# Altium schematic sheet INC-IO1616001.SchDoc
size A1
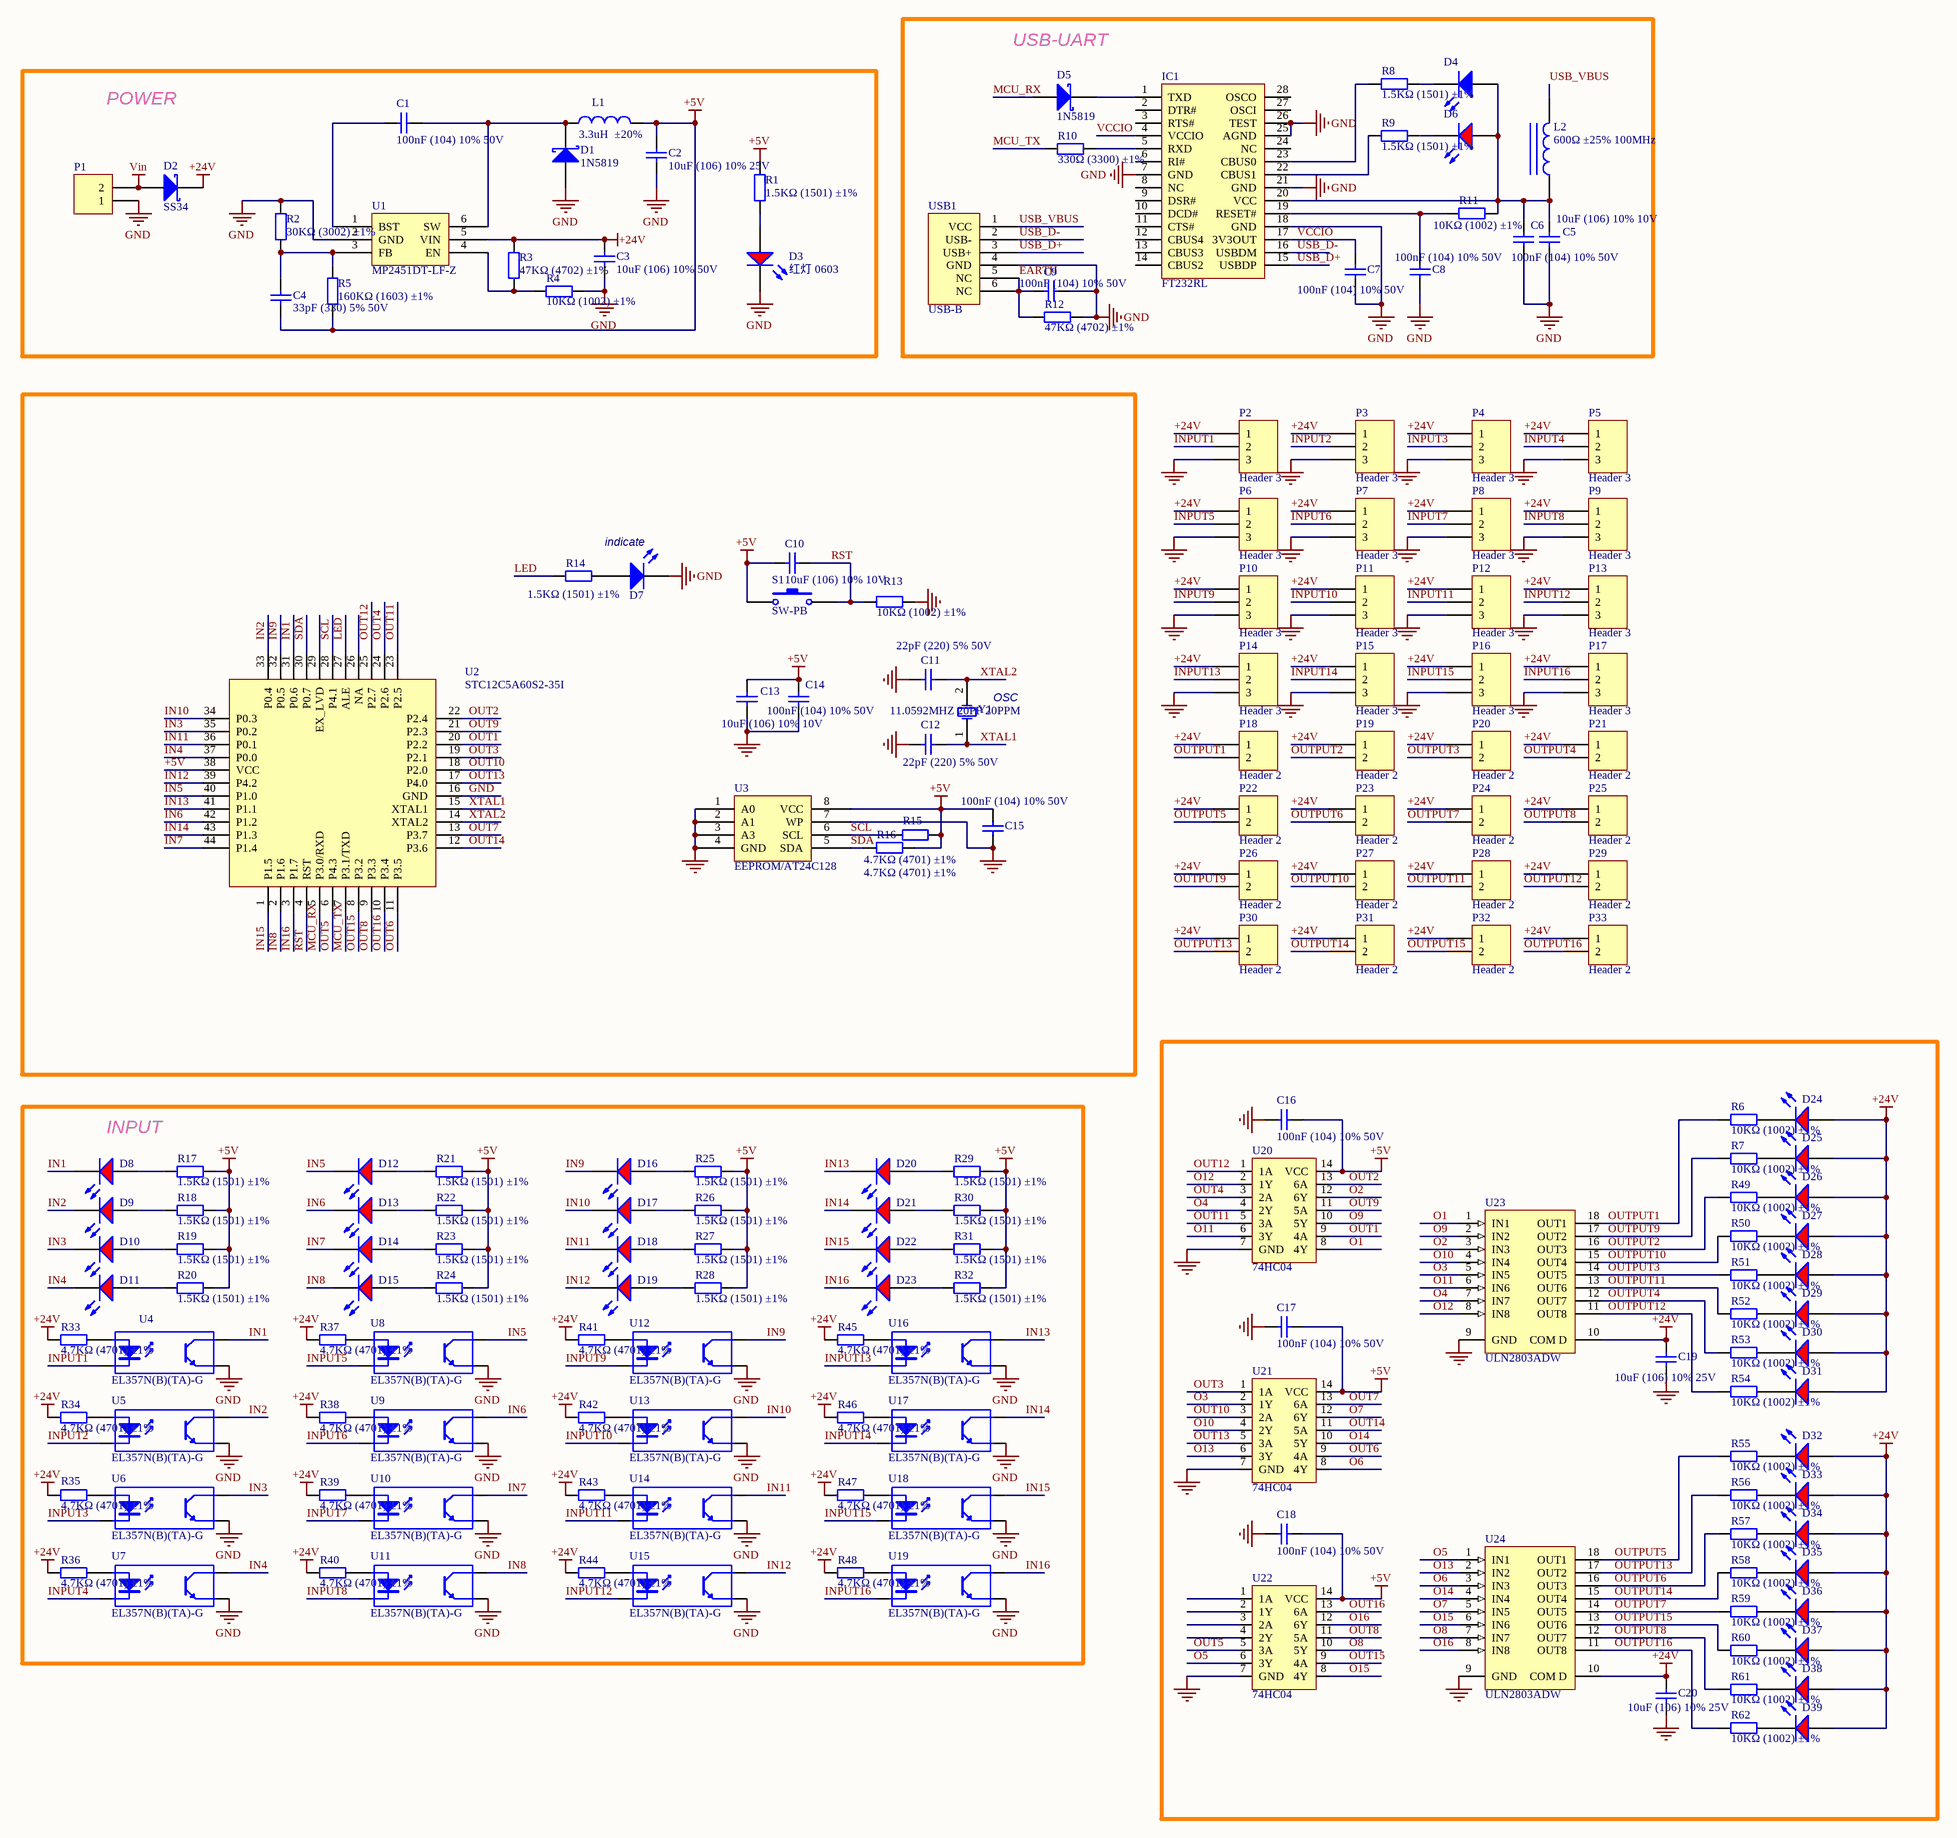
[diagram p0: INC-IO1616001.SchDoc]

## Parts
C1  100nF (104) 10% 50V  [0603_C]
C2  10uF (106) 10% 25V  [0805_C]
C3  10uF (106) 10% 50V  [1206_C]
C4  33pF (330) 5% 50V  [0603_C]
C5  10uF (106) 10% 10V  [0603_C]
C6  100nF (104) 10% 50V  [0603_C]
C7  100nF (104) 10% 50V  [0603_C]
C8  100nF (104) 10% 50V  [0603_C]
C9  100nF (104) 10% 50V  [0603_C]
C10  10uF (106) 10% 10V  [0603_C]
C11  22pF (220) 5% 50V  [0603_C]
C12  22pF (220) 5% 50V  [0603_C]
C13  10uF (106) 10% 10V  [0603_C]
C14  100nF (104) 10% 50V  [0603_C]
C15  100nF (104) 10% 50V  [0603_C]
C16  100nF (104) 10% 50V  [0603_C]
C17  100nF (104) 10% 50V  [0603_C]
C18  100nF (104) 10% 50V  [0603_C]
C19  10uF (106) 10% 25V  [0805_C]
C20  10uF (106) 10% 25V  [0805_C]
D1  1N5819  [SOD-123]
D2  SS34  [SMA(DO-214AC)_S1]
D3  红灯 0603  [0603_LED_S1]
D4  蓝灯 0603  [0603_LED_S1]  (value not drawn)
D5  1N5819  [SOD-123]
D6  红灯 0603  [0603_LED_S1]  (value not drawn)
D7  蓝灯 0603  [0603_LED_S1]  (value not drawn)
D8  红灯 0603  [0603_LED_S1]  (value not drawn)
D9  红灯 0603  [0603_LED_S1]  (value not drawn)
D10  红灯 0603  [0603_LED_S1]  (value not drawn)
D11  红灯 0603  [0603_LED_S1]  (value not drawn)
D12  红灯 0603  [0603_LED_S1]  (value not drawn)
D13  红灯 0603  [0603_LED_S1]  (value not drawn)
D14  红灯 0603  [0603_LED_S1]  (value not drawn)
D15  红灯 0603  [0603_LED_S1]  (value not drawn)
D16  红灯 0603  [0603_LED_S1]  (value not drawn)
D17  红灯 0603  [0603_LED_S1]  (value not drawn)
D18  红灯 0603  [0603_LED_S1]  (value not drawn)
D19  红灯 0603  [0603_LED_S1]  (value not drawn)
D20  红灯 0603  [0603_LED_S1]  (value not drawn)
D21  红灯 0603  [0603_LED_S1]  (value not drawn)
D22  红灯 0603  [0603_LED_S1]  (value not drawn)
D23  红灯 0603  [0603_LED_S1]  (value not drawn)
D24  红灯 0603  [0603_LED_S1]  (value not drawn)
D25  红灯 0603  [0603_LED_S1]  (value not drawn)
D26  红灯 0603  [0603_LED_S1]  (value not drawn)
D27  红灯 0603  [0603_LED_S1]  (value not drawn)
D28  红灯 0603  [0603_LED_S1]  (value not drawn)
D29  红灯 0603  [0603_LED_S1]  (value not drawn)
D30  红灯 0603  [0603_LED_S1]  (value not drawn)
D31  红灯 0603  [0603_LED_S1]  (value not drawn)
D32  红灯 0603  [0603_LED_S1]  (value not drawn)
D33  红灯 0603  [0603_LED_S1]  (value not drawn)
D34  红灯 0603  [0603_LED_S1]  (value not drawn)
D35  红灯 0603  [0603_LED_S1]  (value not drawn)
D36  红灯 0603  [0603_LED_S1]  (value not drawn)
D37  红灯 0603  [0603_LED_S1]  (value not drawn)
D38  红灯 0603  [0603_LED_S1]  (value not drawn)
D39  红灯 0603  [0603_LED_S1]  (value not drawn)
IC1  FT232RL  [SSOP-28_208mil]
L1  3.3uH  ±20%  [L5020]
L2  600Ω ±25% 100MHz  [0805_L]
P1  Header 2  [WJ15EDGVC-3.81-2P]  (value not drawn)
P2  Header 3  [WJ15EDGVC-3.81-3P]
P3  Header 3  [WJ15EDGVC-3.81-3P]
P4  Header 3  [WJ15EDGVC-3.81-3P]
P5  Header 3  [WJ15EDGVC-3.81-3P]
P6  Header 3  [WJ15EDGVC-3.81-3P]
P7  Header 3  [WJ15EDGVC-3.81-3P]
P8  Header 3  [WJ15EDGVC-3.81-3P]
P9  Header 3  [WJ15EDGVC-3.81-3P]
P10  Header 3  [WJ15EDGVC-3.81-3P]
P11  Header 3  [WJ15EDGVC-3.81-3P]
P12  Header 3  [WJ15EDGVC-3.81-3P]
P13  Header 3  [WJ15EDGVC-3.81-3P]
P14  Header 3  [WJ15EDGVC-3.81-3P]
P15  Header 3  [WJ15EDGVC-3.81-3P]
P16  Header 3  [WJ15EDGVC-3.81-3P]
P17  Header 3  [WJ15EDGVC-3.81-3P]
P18  Header 2  [WJ15EDGVC-3.81-2P]
P19  Header 2  [WJ15EDGVC-3.81-2P]
P20  Header 2  [WJ15EDGVC-3.81-2P]
P21  Header 2  [WJ15EDGVC-3.81-2P]
P22  Header 2  [WJ15EDGVC-3.81-2P]
P23  Header 2  [WJ15EDGVC-3.81-2P]
P24  Header 2  [WJ15EDGVC-3.81-2P]
P25  Header 2  [WJ15EDGVC-3.81-2P]
P26  Header 2  [WJ15EDGVC-3.81-2P]
P27  Header 2  [WJ15EDGVC-3.81-2P]
P28  Header 2  [WJ15EDGVC-3.81-2P]
P29  Header 2  [WJ15EDGVC-3.81-2P]
P30  Header 2  [WJ15EDGVC-3.81-2P]
P31  Header 2  [WJ15EDGVC-3.81-2P]
P32  Header 2  [WJ15EDGVC-3.81-2P]
P33  Header 2  [WJ15EDGVC-3.81-2P]
R1  1.5KΩ (1501) ±1%  [0603_R]
R2  30KΩ (3002) ±1%  [0603_R]
R3  47KΩ (4702) ±1%  [0603_R]
R4  10KΩ (1002) ±1%  [0603_R]
R5  160KΩ (1603) ±1%  [0603_R]
R6  10KΩ (1002) ±1%  [0603_R]
R7  10KΩ (1002) ±1%  [0603_R]
R8  1.5KΩ (1501) ±1%  [0603_R]
R9  1.5KΩ (1501) ±1%  [0603_R]
R10  330Ω (3300) ±1%  [0603_R]
R11  10KΩ (1002) ±1%  [0603_R]
R12  47KΩ (4702) ±1%  [0603_R]
R13  10KΩ (1002) ±1%  [0603_R]
R14  1.5KΩ (1501) ±1%  [0603_R]
R15  4.7KΩ (4701) ±1%  [0603_R]
R16  4.7KΩ (4701) ±1%  [0603_R]
R17  1.5KΩ (1501) ±1%  [0603_R]
R18  1.5KΩ (1501) ±1%  [0603_R]
R19  1.5KΩ (1501) ±1%  [0603_R]
R20  1.5KΩ (1501) ±1%  [0603_R]
R21  1.5KΩ (1501) ±1%  [0603_R]
R22  1.5KΩ (1501) ±1%  [0603_R]
R23  1.5KΩ (1501) ±1%  [0603_R]
R24  1.5KΩ (1501) ±1%  [0603_R]
R25  1.5KΩ (1501) ±1%  [0603_R]
R26  1.5KΩ (1501) ±1%  [0603_R]
R27  1.5KΩ (1501) ±1%  [0603_R]
R28  1.5KΩ (1501) ±1%  [0603_R]
R29  1.5KΩ (1501) ±1%  [0603_R]
R30  1.5KΩ (1501) ±1%  [0603_R]
R31  1.5KΩ (1501) ±1%  [0603_R]
R32  1.5KΩ (1501) ±1%  [0603_R]
R33  4.7KΩ (4701) ±1%  [1206_R]
R34  4.7KΩ (4701) ±1%  [1206_R]
R35  4.7KΩ (4701) ±1%  [1206_R]
R36  4.7KΩ (4701) ±1%  [1206_R]
R37  4.7KΩ (4701) ±1%  [1206_R]
R38  4.7KΩ (4701) ±1%  [1206_R]
R39  4.7KΩ (4701) ±1%  [1206_R]
R40  4.7KΩ (4701) ±1%  [1206_R]
R41  4.7KΩ (4701) ±1%  [1206_R]
R42  4.7KΩ (4701) ±1%  [1206_R]
R43  4.7KΩ (4701) ±1%  [1206_R]
R44  4.7KΩ (4701) ±1%  [1206_R]
R45  4.7KΩ (4701) ±1%  [1206_R]
R46  4.7KΩ (4701) ±1%  [1206_R]
R47  4.7KΩ (4701) ±1%  [1206_R]
R48  4.7KΩ (4701) ±1%  [1206_R]
R49  10KΩ (1002) ±1%  [0603_R]
R50  10KΩ (1002) ±1%  [0603_R]
R51  10KΩ (1002) ±1%  [0603_R]
R52  10KΩ (1002) ±1%  [0603_R]
R53  10KΩ (1002) ±1%  [0603_R]
R54  10KΩ (1002) ±1%  [0603_R]
R55  10KΩ (1002) ±1%  [0603_R]
R56  10KΩ (1002) ±1%  [0603_R]
R57  10KΩ (1002) ±1%  [0603_R]
R58  10KΩ (1002) ±1%  [0603_R]
R59  10KΩ (1002) ±1%  [0603_R]
R60  10KΩ (1002) ±1%  [0603_R]
R61  10KΩ (1002) ±1%  [0603_R]
R62  10KΩ (1002) ±1%  [0603_R]
S1  SW-PB  [贴片按键 3*6*2.5]
U1  MP2451DT-LF-Z  [SOT-23-6]
U2  STC12C5A60S2-35I  [LQFP-44_10x10x08P]
U3  EEPROM/AT24C128  [SOIC-8_150mil]
U4  EL357N(B)(TA)-G  [SOP-4_P2.54]
U5  EL357N(B)(TA)-G  [SOP-4_P2.54]
U6  EL357N(B)(TA)-G  [SOP-4_P2.54]
U7  EL357N(B)(TA)-G  [SOP-4_P2.54]
U8  EL357N(B)(TA)-G  [SOP-4_P2.54]
U9  EL357N(B)(TA)-G  [SOP-4_P2.54]
U10  EL357N(B)(TA)-G  [SOP-4_P2.54]
U11  EL357N(B)(TA)-G  [SOP-4_P2.54]
U12  EL357N(B)(TA)-G  [SOP-4_P2.54]
U13  EL357N(B)(TA)-G  [SOP-4_P2.54]
U14  EL357N(B)(TA)-G  [SOP-4_P2.54]
U15  EL357N(B)(TA)-G  [SOP-4_P2.54]
U16  EL357N(B)(TA)-G  [SOP-4_P2.54]
U17  EL357N(B)(TA)-G  [SOP-4_P2.54]
U18  EL357N(B)(TA)-G  [SOP-4_P2.54]
U19  EL357N(B)(TA)-G  [SOP-4_P2.54]
U20  74HC04  [SOIC-14_150mil]
U21  74HC04  [SOIC-14_150mil]
U22  74HC04  [SOIC-14_150mil]
U23  ULN2803ADW  [SOIC-18_300mil]
U24  ULN2803ADW  [SOIC-18_300mil]
USB1  USB-B  [USB-b]
Y1  11.0592MHZ 20PF 20PPM  [SMD-5032_2P]

## Blocks framed on the sheet
USB-UART: C5-C9 D4-D6 IC1 L2 R8-R12 USB1
POWER: C1-C4 D1-D3 L1 P1 R1-R5 U1
INPUT: D8-D23 R17-R48 U4-U19

## Nets
+5V: C2.2 C4.2 C10.2 C13.2 C14.2 C15.2 C16.2 C17.2 C18.2 L1.2 R1.2 R5.1 R15.2 R16.2 R17.1 R18.1 R19.1 R20.1 R21.1 R22.1 R23.1 R24.1 R25.1 R26.1 R27.1 R28.1 R29.1 R30.1 R31.1 R32.1 S1.1 U2.38(VCC) U3.8(VCC) U20.14(VCC) U21.14(VCC) U22.14(VCC)
+24V: C3.2 C19.2 C20.2 D2.2(K) D24.A D25.A D26.A D27.A D28.A D29.A D30.A D31.A D32.A D33.A D34.A D35.A D36.A D37.A D38.A D39.A P2.1 P3.1 P4.1 P5.1 P6.1 P7.1 P8.1 P9.1 P10.1 P11.1 P12.1 P13.1 P14.1 P15.1 P16.1 P17.1 P18.1 P19.1 P20.1 P21.1 P22.1 P23.1 P24.1 P25.1 P26.1 P27.1 P28.1 P29.1 P30.1 P31.1 P32.1 P33.1 R3.1 R33.1 R34.1 R35.1 R36.1 R37.1 R38.1 R39.1 R40.1 R41.1 R42.1 R43.1 R44.1 R45.1 R46.1 R47.1 R48.1 U1.5(VIN) U23.10(COM_D) U24.10(COM_D)
GND: C2.1 C3.1 C5.1 C6.1 C7.1 C8.1 C9.2 C11.2 C12.2 C13.1 C14.1 C15.1 C16.1 C17.1 C18.1 C19.1 C20.1 D1.1(A) D3.K D7.K IC1.7(GND) IC1.18(GND) IC1.21(GND) IC1.25(AGND) IC1.26(TEST) P1.1 P2.3 P3.3 P4.3 P5.3 P6.3 P7.3 P8.3 P9.3 P10.3 P11.3 P12.3 P13.3 P14.3 P15.3 P16.3 P17.3 R2.2 R4.2 R12.2 R13.2 U1.2(GND) U2.16(GND) U3.1(A0) U3.2(A1) U3.3(A3) U3.4(GND) U3.7(WP) U4.3(E) U5.3(E) U6.3(E) U7.3(E) U8.3(E) U9.3(E) U10.3(E) U11.3(E) U12.3(E) U13.3(E) U14.3(E) U15.3(E) U16.3(E) U17.3(E) U18.3(E) U19.3(E) U20.7(GND) U21.7(GND) U22.7(GND) U23.9(GND) U24.9(GND) USB1.4(GND)
Vin: D2.1(A) P1.2
EARTH: C9.1 R12.1 USB1.5(NC) USB1.6(NC)
IN1: D8.K U2.31(P0.6) U4.4(C)
IN2: D9.K U2.33(P0.4) U5.4(C)
IN3: D10.K U2.35(P0.2) U6.4(C)
IN4: D11.K U2.37(P0.0) U7.4(C)
IN5: D12.K U2.40(P1.0) U8.4(C)
IN6: D13.K U2.42(P1.2) U9.4(C)
IN7: D14.K U2.44(P1.4) U10.4(C)
IN8: D15.K U2.2(P1.6) U11.4(C)
IN9: D16.K U2.32(P0.5) U12.4(C)
IN10: D17.K U2.34(P0.3) U13.4(C)
IN11: D18.K U2.36(P0.1) U14.4(C)
IN12: D19.K U2.39(P4.2) U15.4(C)
IN13: D20.K U2.41(P1.1) U16.4(C)
IN14: D21.K U2.43(P1.3) U17.4(C)
IN15: D22.K U2.1(P1.5) U18.4(C)
IN16: D23.K U2.3(P1.7) U19.4(C)
INPUT1: P2.2 U4.2(K)
INPUT2: P3.2 U5.2(K)
INPUT3: P4.2 U6.2(K)
INPUT4: P5.2 U7.2(K)
INPUT5: P6.2 U8.2(K)
INPUT6: P7.2 U9.2(K)
INPUT7: P8.2 U10.2(K)
INPUT8: P9.2 U11.2(K)
INPUT9: P10.2 U12.2(K)
INPUT10: P11.2 U13.2(K)
INPUT11: P12.2 U14.2(K)
INPUT12: P13.2 U15.2(K)
INPUT13: P14.2 U16.2(K)
INPUT14: P15.2 U17.2(K)
INPUT15: P16.2 U18.2(K)
INPUT16: P17.2 U19.2(K)
LED: R14.2 U2.27(ALE)
MCU_RX: D5.1(A) U2.5(P3.0/RXD)
MCU_TX: R10.1 U2.7(P3.1/TXD)
O1: U20.8(4Y) U23.1(IN1)
O2: U20.12(6Y) U23.3(IN3)
O3: U21.2(1Y) U23.5(IN5)
O4: U20.4(2Y) U23.7(IN7)
O5: U22.6(3Y) U24.1(IN1)
O6: U21.8(4Y) U24.3(IN3)
O7: U21.12(6Y) U24.5(IN5)
O8: U22.10(5Y) U24.7(IN7)
O9: U20.10(5Y) U23.2(IN2)
O10: U21.4(2Y) U23.4(IN4)
O11: U20.6(3Y) U23.6(IN6)
O12: U20.2(1Y) U23.8(IN8)
O13: U21.6(3Y) U24.2(IN2)
O14: U21.10(5Y) U24.4(IN4)
O15: U22.8(4Y) U24.6(IN6)
O16: U22.12(6Y) U24.8(IN8)
OUT1: U2.20(P2.2) U20.9(4A)
OUT2: U2.22(P2.4) U20.13(6A)
OUT3: U2.19(P2.1) U21.1(1A)
OUT4: U2.24(P2.6) U20.3(2A)
OUT5: U2.6(P4.3) U22.5(3A)
OUT6: U2.11(P3.5) U21.9(4A)
OUT7: U2.13(P3.7) U21.13(6A)
OUT8: U2.9(P3.3) U22.11(5A)
OUT9: U2.21(P2.3) U20.11(5A)
OUT10: U2.18(P2.0) U21.3(2A)
OUT11: U2.23(P2.5) U20.5(3A)
OUT12: U2.25(P2.7) U20.1(1A)
OUT13: U2.17(P4.0) U21.5(3A)
OUT14: U2.12(P3.6) U21.11(5A)
OUT15: U2.8(P3.2) U22.9(4A)
OUT16: U2.10(P3.4) U22.13(6A)
OUTPUT1: P18.2 R6.1 U23.18(OUT1)
OUTPUT2: P19.2 R49.1 U23.16(OUT3)
OUTPUT3: P20.2 R51.1 U23.14(OUT5)
OUTPUT4: P21.2 R53.1 U23.12(OUT7)
OUTPUT5: P22.2 R55.1 U24.18(OUT1)
OUTPUT6: P23.2 R57.1 U24.16(OUT3)
OUTPUT7: P24.2 R59.1 U24.14(OUT5)
OUTPUT8: P25.2 R61.1 U24.12(OUT7)
OUTPUT9: P26.2 R7.1 U23.17(OUT2)
OUTPUT10: P27.2 R50.1 U23.15(OUT4)
OUTPUT11: P28.2 R52.1 U23.13(OUT6)
OUTPUT12: P29.2 R54.1 U23.11(OUT8)
OUTPUT13: P30.2 R56.1 U24.17(OUT2)
OUTPUT14: P31.2 R58.1 U24.15(OUT4)
OUTPUT15: P32.2 R60.1 U24.13(OUT6)
OUTPUT16: P33.2 R62.1 U24.11(OUT8)
RST: C10.1 R13.1 S1.2 U2.4(RST)
SCL: R15.1 U2.28(P4.1) U3.6(SCL)
SDA: R16.1 U2.30(P0.7) U3.5(SDA)
USB_D+: IC1.15(USBDP) USB1.3(USB+)
USB_D-: IC1.16(USBDM) USB1.2(USB-)
USB_VBUS: L2.2 USB1.1(VCC)
VCCIO: C7.2 IC1.4(VCCIO) IC1.17(3V3OUT)
XTAL1: C12.1 U2.15(XTAL1) Y1.1(OSC1)
XTAL2: C11.1 U2.14(XTAL2) Y1.2(OSC2)
NetC1_1: C1.1 D1.2(K) L1.1 U1.6(SW)
NetC1_2: C1.2 U1.1(BST)
NetC4_1: C4.1 R2.1 R5.2 U1.3(FB)
NetC5_2: C5.2 C6.2 D4.A D6.A IC1.20(VCC) L2.1 R11.2
NetC8_2: C8.2 IC1.19(RESET#) R11.1
NetD3_A: D3.A R1.1
NetD4_K: D4.K R8.2
NetD5_2: D5.2(K) IC1.1(TXD)
NetD6_K: D6.K R9.2
NetD7_A: D7.A R14.1
NetD8_A: D8.A R17.2
NetD9_A: D9.A R18.2
NetD10_A: D10.A R19.2
NetD11_A: D11.A R20.2
NetD12_A: D12.A R21.2
NetD13_A: D13.A R22.2
NetD14_A: D14.A R23.2
NetD15_A: D15.A R24.2
NetD16_A: D16.A R25.2
NetD17_A: D17.A R26.2
NetD18_A: D18.A R27.2
NetD19_A: D19.A R28.2
NetD20_A: D20.A R29.2
NetD21_A: D21.A R30.2
NetD22_A: D22.A R31.2
NetD23_A: D23.A R32.2
NetD24_K: D24.K R6.2
NetD25_K: D25.K R7.2
NetD26_K: D26.K R49.2
NetD27_K: D27.K R50.2
NetD28_K: D28.K R51.2
NetD29_K: D29.K R52.2
NetD30_K: D30.K R53.2
NetD31_K: D31.K R54.2
NetD32_K: D32.K R55.2
NetD33_K: D33.K R56.2
NetD34_K: D34.K R57.2
NetD35_K: D35.K R58.2
NetD36_K: D36.K R59.2
NetD37_K: D37.K R60.2
NetD38_K: D38.K R61.2
NetD39_K: D39.K R62.2
NetIC1_5: IC1.5(RXD) R10.2
NetIC1_22: IC1.22(CBUS1) R9.1
NetIC1_23: IC1.23(CBUS0) R8.1
NetR3_2: R3.2 R4.1 U1.4(EN)
NetR33_2: R33.2 U4.1(A)
NetR34_2: R34.2 U5.1(A)
NetR35_2: R35.2 U6.1(A)
NetR36_2: R36.2 U7.1(A)
NetR37_2: R37.2 U8.1(A)
NetR38_2: R38.2 U9.1(A)
NetR39_2: R39.2 U10.1(A)
NetR40_2: R40.2 U11.1(A)
NetR41_2: R41.2 U12.1(A)
NetR42_2: R42.2 U13.1(A)
NetR43_2: R43.2 U14.1(A)
NetR44_2: R44.2 U15.1(A)
NetR45_2: R45.2 U16.1(A)
NetR46_2: R46.2 U17.1(A)
NetR47_2: R47.2 U18.1(A)
NetR48_2: R48.2 U19.1(A)

Not connected (* = marked no-connect by the designer): IC1 2(DTR#) 3(RTS#) 6(RI#) 8(NC) 9(DSR#) 10(DCD#) 11(CTS#) 12(CBUS4) 13(CBUS3) 14(CBUS2) 24(NC) 27(OSCI) 28(OSCO); U2 26(NA) 29(EX_LVD); U22 1(1A) 2(1Y) 3(2A) 4(2Y)

## Notes on the sheet
- indicate
- (near Y1) OSC

## Library data of the parts
C1 C6-C9 C14-C18 = 0603 100nF (104) 10% 50V: 贴片电容; ComponentLink1Description: 供应商链接; ComponentLink1URL: http://www.szlcsc.com/product/details_15331.html; Package: 0603; Supplier: LC; SuppliersPartNumber: C14663
C2 C19 C20 = 0805 10uF (106) 10% 25V: 贴片电容; ComponentLink1Description: 供应商链接; ComponentLink1URL: http://www.szlcsc.com/product/details_16532.html; Package: 0805; Supplier: LC; SuppliersPartNumber: C15850
C3 = 1206 10uF (106) 10% 50V: 贴片电容; ComponentLink1Description: 供应商链接; ComponentLink1URL: http://www.szlcsc.com/product/details_14236.html; Package: 1206; Supplier: LC; SuppliersPartNumber: C13585
C4 = 0603 33pF (330) 5% 50V: 贴片电容; ComponentLink1Description: 供应商链接; ComponentLink1URL: http://www.szlcsc.com/product/details_2015.html; Package: 0603; Supplier: LC; SuppliersPartNumber: C1663
C5 C10 C13 = 0603 10uF (106) 10% 10V: 贴片电容; ComponentLink1Description: 供应商链接; ComponentLink1URL: http://www.szlcsc.com/product/details_20411.html; Package: 0603; Supplier: LC; SuppliersPartNumber: C19702
C11 C12 = 0603 22pF (220) 5% 50V: 贴片电容; ComponentLink1Description: 供应商链接; ComponentLink1URL: http://www.szlcsc.com/product/details_2005.html; Package: 0603; Supplier: LC; SuppliersPartNumber: C1653
D1 D2 D5 = D Schottky: Schottky Diode; Published: 8-Jun-2000; LatestRevisionDate: 17-Jul-2002; LatestRevisionNote: Re-released for DXP Platform.; PackageReference: SMB; Publisher: Altium Limited; Code_JEDEC: DO-214-AA
D3 D6 D8-D39 = 0603 红灯: 发光二极管; ComponentLink1Description: 供应商链接; ComponentLink1URL: http://www.szlcsc.com/product/details_2659.html; Package: 0603; Supplier: LC; SuppliersPartNumber: C2286
D4 D7 = 0603 蓝灯: 发光二极管; ComponentLink1Description: 供应商链接; ComponentLink1URL: http://www.szlcsc.com/product/details_73150.html; Package: 0603; Supplier: LC; SuppliersPartNumber: C72041
L1 = Inductor: Code_IEC: 1005; Value: 4.7uH  ±10%; Published: 8-Jun-2000; LatestRevisionDate: 29-May-2009; LatestRevisionNote: IPC-7351 Footprint Added.; PackageReference: 0402-A; Publisher: Altium Limited; PackageDescription: Chip Inductor; Code_JEITA: 0402
L2 = 0805 600Ω 25% 100MHz: 贴片磁珠; ComponentLink1Description: 供应商链接; ComponentLink1URL: http://www.szlcsc.com/product/details_1369.html; Package: 0805; Supplier: LC; SuppliersPartNumber: C1017
P1 P18-P33 = Header 2: Header, 2-Pin; LatestRevisionDate: 17-Jul-2002; LatestRevisionNote: Re-released for DXP Platform.; Publisher: Altium Limited
P2-P17 = Header 3: Header, 3-Pin; LatestRevisionDate: 17-Jul-2002; LatestRevisionNote: Re-released for DXP Platform.; Publisher: Altium Limited
R1 R8 R9 R14 R17-R32 = 0603 1.5KΩ (1501) 1%: 贴片电阻; ComponentLink1Description: 供应商链接; ComponentLink1URL: http://www.szlcsc.com/product/details_23570.html; Package: 0603; Supplier: LC; SuppliersPartNumber: C22843
R2 = 0603 30KΩ (3002) 1%: 贴片电阻; ComponentLink1Description: 供应商链接; ComponentLink1URL: http://www.szlcsc.com/product/details_23711.html; Package: 0603; Supplier: LC; SuppliersPartNumber: C22984
R3 R12 = 0603 47KΩ (4702) 1%: 贴片电阻; ComponentLink1Description: 供应商链接; ComponentLink1URL: http://www.szlcsc.com/product/details_26562.html; Package: 0603; Supplier: LC; SuppliersPartNumber: C25819
R4 R6 R7 R11 R13 R49-R62 = 0603 10KΩ (1002) 1%: 贴片电阻; ComponentLink1Description: 供应商链接; ComponentLink1URL: http://www.szlcsc.com/product/details_26547.html; Package: 0603; Supplier: LC; SuppliersPartNumber: C25804
R5 = 0603 160KΩ (1603) 1%: 贴片电阻; ComponentLink1Description: 供应商链接; ComponentLink1URL: http://www.szlcsc.com/product/details_23540.html; Package: 0603; Supplier: LC; SuppliersPartNumber: C22813
R10 = 0603 330Ω (3300) 1%: 贴片电阻; ComponentLink1Description: 供应商链接; ComponentLink1URL: http://www.szlcsc.com/product/details_23865.html; Package: 0603; Supplier: LC; SuppliersPartNumber: C23138
R15 R16 = 0603 4.7KΩ (4701) 1%: 贴片电阻; ComponentLink1Description: 供应商链接; ComponentLink1URL: http://www.szlcsc.com/product/details_23889.html; Package: 0603; Supplier: LC; SuppliersPartNumber: C23162
R33-R48 = 1206 4.7KΩ (4701) 1%: 贴片电阻; ComponentLink1Description: 供应商链接; ComponentLink1URL: http://www.szlcsc.com/product/details_18624.html; Package: 1206; Supplier: LC; SuppliersPartNumber: C17936
S1 = SW-PB: Switch; Published: 24-Mar-1999; LatestRevisionDate: 17-Jul-2002; LatestRevisionNote: Re-released for DXP Platform.; PackageReference: SPST-2; Publisher: Altium Limited; PackageDescription: Switch; 2 Leads
U1 = MP2451DT-LF-Z: DC-DC芯片; ComponentLink1Description: 供应商链接; ComponentLink1URL: http://www.szlcsc.com/product/details_14780.html; Package: SOT-23-6; Supplier: LC; SuppliersPartNumber: C14123
U2 = STC12C5A60S2-35I: MCU; ComponentLink1Description: 供应商链接; ComponentLink1URL: http://www.szlcsc.com/product/details_9202.html; Package: LQFP-44_10x10x08P; Supplier: LC; SuppliersPartNumber: C8696
U3 = EEPROM/AT24C256C-SSHL-T: EEPROM; ComponentLink1Description: 供应商链接; ComponentLink1URL: http://www.szlcsc.com/product/details_6947.html; Package: SOIC-8_150mil; Supplier: LC; SuppliersPartNumber: C6482
U4-U19 = EL357N(B)(TA)-G: 贴片光耦; ComponentLink1Description: 供应商链接; ComponentLink1URL: http://www.szlcsc.com/product/details_7114.html; Package: SOP-4_P2.54; Supplier: LC; SuppliersPartNumber: C6649
U23 U24 = ULN2803ADW: 大电流驱动; ComponentLink1Description: 供应商链接; ComponentLink1URL: http://www.szlcsc.com/product/details_10213.html; Package: SOIC-18_300mil; Supplier: LC; SuppliersPartNumber: C9683
USB1 = USB-6
Y1 = SMD-5032_2P 11.0592MHZ 20PF 20PPM: 贴片晶振; ComponentLink1Description: 供应商链接; ComponentLink1URL: http://www.szlcsc.com/product/details_53039.html; Package: SMD-5032_2P; Supplier: LC; SuppliersPartNumber: C52026